# Altium schematic sheet front_ultrasonic_radar.SchDoc
size A3; SheetNumber: 4; SheetTotal: 6
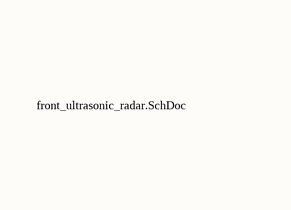
[diagram p0: front_ultrasonic_radar.SchDoc, left]
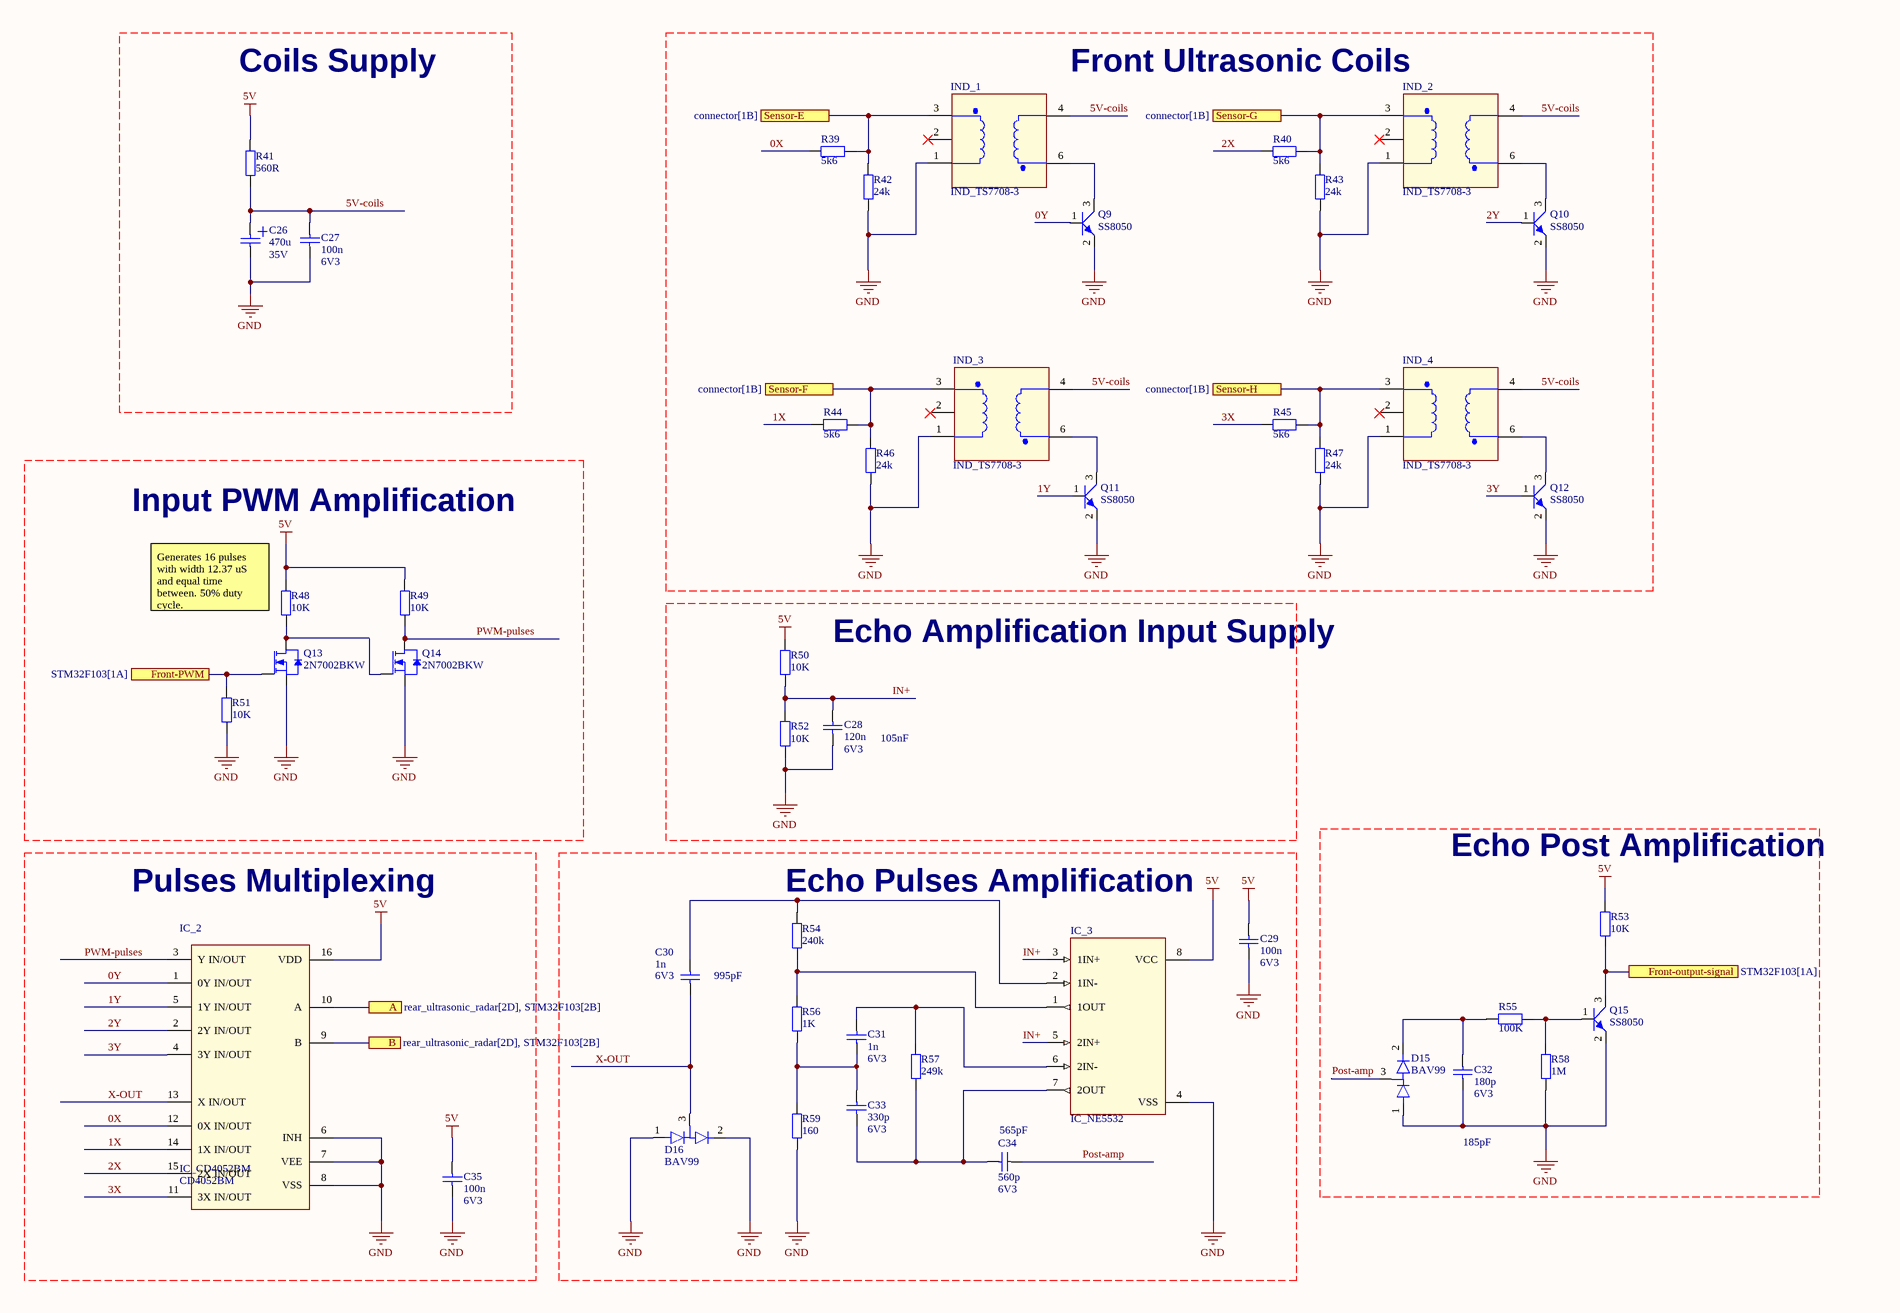
[diagram p1: front_ultrasonic_radar.SchDoc, right]

## Parts
C26  Value1: 470u  Value2: 35V  [CAP_Panasonic_EEE-FK1V471SP]  (hidden comment: CAP_POL)
C27  Value1: 100n  Value2: 6V3  [CAPC2012X88N]  (hidden comment: CAP)
C28  Value1: 120n  Value2: 6V3  [CAPC2012X88N]  (hidden comment: CAP)
C29  Value1: 100n  Value2: 6V3  [CAPC2012X88N]  (hidden comment: CAP)
C30  Value1: 1n  Value2: 6V3  [CAPC2012X88N]  (hidden comment: CAP)
C31  Value1: 1n  Value2: 6V3  [CAPC2012X88N]  (hidden comment: CAP)
C32  Value1: 180p  Value2: 6V3  [CAPC2012X88N]  (hidden comment: CAP)
C33  Value1: 330p  Value2: 6V3  [CAPC2012X88N]  (hidden comment: CAP)
C34  Value1: 560p  Value2: 6V3  [CAPC2012X88N]  (hidden comment: CAP)
C35  Value1: 100n  Value2: 6V3  [CAPC2012X88N]  (hidden comment: CAP)
D15  Value1: BAV99  [DIO_BAV99-SOT23]  (hidden comment: High-speed double diode)
D16  Value1: BAV99  [DIO_BAV99-SOT23]  (hidden comment: High-speed double diode)
IC_2  IC_CD4052BM  Value1: CD4052BM  [SOP-16]
IC_3  IC_NE5532
IND_1  IND_TS7708-3
IND_2  IND_TS7708-3
IND_3  IND_TS7708-3
IND_4  IND_TS7708-3
Q9  Value1: SS8050  [SOT23]  (hidden comment: TRS_NPN_123)
Q10  Value1: SS8050  [SOT23]  (hidden comment: TRS_NPN_123)
Q11  Value1: SS8050  [SOT23]  (hidden comment: TRS_NPN_123)
Q12  Value1: SS8050  [SOT23]  (hidden comment: TRS_NPN_123)
Q13  Value1: 2N7002BKW  [SOT65P210X110-3N]  (hidden comment: TRS_FETN_123)
Q14  Value1: 2N7002BKW  [SOT65P210X110-3N]  (hidden comment: TRS_FETN_123)
Q15  Value1: SS8050  [SOT23]  (hidden comment: TRS_NPN_123)
R39  Value1: 5k6  [RESC2012X60N]  (hidden comment: RES)
R40  Value1: 5k6  [RESC2012X60N]  (hidden comment: RES)
R41  Value1: 560R  [RESC2012X60N]  (hidden comment: RES)
R42  Value1: 24k  [RESC2012X60N]  (hidden comment: RES)
R43  Value1: 24k  [RESC2012X60N]  (hidden comment: RES)
R44  Value1: 5k6  [RESC2012X60N]  (hidden comment: RES)
R45  Value1: 5k6  [RESC2012X60N]  (hidden comment: RES)
R46  Value1: 24k  [RESC2012X60N]  (hidden comment: RES)
R47  Value1: 24k  [RESC2012X60N]  (hidden comment: RES)
R48  Value1: 10K  [RESC2012X60N]  (hidden comment: RES)
R49  Value1: 10K  [RESC2012X60N]  (hidden comment: RES)
R50  Value1: 10K  [RESC2012X60N]  (hidden comment: RES)
R51  Value1: 10K  [RESC2012X60N]  (hidden comment: RES)
R52  Value1: 10K  [RESC2012X60N]  (hidden comment: RES)
R53  Value1: 10K  [RESC2012X60N]  (hidden comment: RES)
R54  Value1: 240k  [RESC2012X60N]  (hidden comment: RES)
R55  Value1: 100K  [RESC2012X60N]  (hidden comment: RES)
R56  Value1: 1K  [RESC2012X60N]  (hidden comment: RES)
R57  Value1: 249k  [RESC2012X60N]  (hidden comment: RES)
R58  Value1: 1M  [RESC2012X60N]  (hidden comment: RES)
R59  Value1: 160  [RESC2012X60N]  (hidden comment: RES)

## Ports
A (see rear_ultrasonic_radar[2D], STM32F103[2B]), B (see rear_ultrasonic_radar[2D], STM32F103[2B]), Front-output-signal (see STM32F103[1A]), Front-PWM (see STM32F103[1A]), Sensor-E (see connector[1B]), Sensor-F (see connector[1B]), Sensor-G (see connector[1B]), Sensor-H (see connector[1B])

## Nets
5V: C29.2 C35.2 IC_2.16(VDD) IC_3.8(VCC) R41.2 R48.2 R49.2 R50.1 R53.2
GND: C26.2 C27.1 C28.1 C29.1 C32.1 C35.1 D15.1(A1) D16.1(A1) D16.2(A2) IC_2.6(INH) IC_2.7(VEE) IC_2.8(VSS) IC_3.4(VSS) IND_1.1 IND_2.1 IND_3.1 IND_4.1 Q9.2(E) Q10.2(E) Q11.2(E) Q12.2(E) Q13.2(S) Q14.2(S) Q15.2(E) R42.1 R43.1 R46.1 R47.1 R51.1 R52.1 R58.1 R59.1
0X: IC_2.12(0X_IN/OUT) R39.2
0Y: IC_2.1(0Y_IN/OUT) Q9.1(B)
1X: IC_2.14(1X_IN/OUT) R44.2
1Y: IC_2.5(1Y_IN/OUT) Q11.1(B)
2X: IC_2.15(2X_IN/OUT) R40.2
2Y: IC_2.2(2Y_IN/OUT) Q10.1(B)
3X: IC_2.11(3X_IN/OUT) R45.2
3Y: IC_2.4(3Y_IN/OUT) Q12.1(B)
5V-coils: C26.1 C27.2 IND_1.4 IND_2.4 IND_3.4 IND_4.4 R41.1
A: IC_2.10(A) ; port A
B: IC_2.9(B) ; port B
Front-output-signal: Q15.3(C) R53.1 ; port Front-output-signal
Front-PWM: Q13.1(G) R51.2 ; port Front-PWM
IN+: C28.2 IC_3.3(1IN+) IC_3.5(2IN+) R50.2 R52.2
Post-amp: C34.1 D15.3(K)
PWM-pulses: IC_2.3(Y_IN/OUT) Q14.3(D) R49.1
Sensor-E: IND_1.3(S2) R39.1 R42.2 ; port Sensor-E
Sensor-F: IND_3.3(S2) R44.1 R46.2 ; port Sensor-F
Sensor-G: IND_2.3(S2) R40.1 R43.2 ; port Sensor-G
Sensor-H: IND_4.3(S2) R45.1 R47.2 ; port Sensor-H
X-OUT: C30.1 D16.3(K) IC_2.13(X_IN/OUT)
NetC30_2: C30.2 IC_3.2(1IN-) R54.1
NetC31_1: C31.1 IC_3.6(2IN-) R57.1
NetC31_2: C31.2 C33.2 R56.1 R59.2
NetC32_2: C32.2 D15.2(A2) R55.1
NetC33_1: C33.1 C34.2 IC_3.7(2OUT) R57.2
NetIC_3_1: IC_3.1(1OUT) R54.2 R56.2
NetIND_1_6: IND_1.6(S1) Q9.3(C)
NetIND_2_6: IND_2.6(S1) Q10.3(C)
NetIND_3_6: IND_3.6(S1) Q11.3(C)
NetIND_4_6: IND_4.6(S1) Q12.3(C)
NetQ13_3: Q13.3(D) Q14.1(G) R48.1
NetQ15_1: Q15.1(B) R55.2 R58.2

Not connected (* = marked no-connect by the designer): IND_1 2*; IND_2 2*; IND_3 2*; IND_4 2*

## Notes on the sheet
- Coils Supply
- Front Ultrasonic Coils
- Input PWM Amplification
- (near R48) Generates 16 pulses with width 12.37 uS and equal time between. 50% duty cycle.
- front_ultrasonic_radar.SchDoc
- Echo Amplification Input Supply
- (near C28) 105nF
- (near R53) Echo Post Amplification
- Pulses Multiplexing
- (near R54) Echo Pulses Amplification
- (near C30) 995pF
- (near C34) 565pF
- 185pF

## Library data of the parts
C26 = 01_01555: Aluminium Electrolytic Capacitors - SMD 35volts 470uF SMD AEC-Q200 Reflow Only; Manufacturer: Panasonic; Manufacturer PN: EEE-FK1V471SP; AutoId: 1556; SubType: Electrolyte; Id: 01_01555; DeviceType: capacitor; Status: 0 - Unchecked; MountType: SMT; ComponentLink1URL: X:\01_Datasheets\CAP_Panasonic_FKS.pdf; Supplier 1: Mouser; Supplier Part Number 1: 667-EEE-FK1V471SP; ComponentLink1Description: Datasheet
C27 C29 C35 = 01_00637: X7R 10% 0805; Manufacturer: KEMET; Manufacturer PN: C0805C104K9RACTU; AutoId: 637; DeviceType: capacitor; SubType: Ceramic; Id: 01_00637; Status: 2 - Checked and Approved; MountType: SMT; ComponentLink1URL: X:\01_Datasheets\CAP_KEMET_CxxxxCxxxXxRAC.pdf; Supplier 1: Farnell; Supplier Part Number 1: 80-C0805C104K9R; ComponentLink1Description: Datasheet
C28 = 01_00638: X7R 10% 0805; Manufacturer: KEMET; Manufacturer PN: C0805C124K9RACTU; AutoId: 638; DeviceType: capacitor; SubType: Ceramic; Id: 01_00638; Status: 2 - Checked and Approved; MountType: SMT; ComponentLink1URL: X:\01_Datasheets\CAP_KEMET_CxxxxCxxxXxRAC.pdf; Supplier 1: Farnell; ComponentLink1Description: Datasheet
C30 C31 = 01_00613: X7R 10% 0805; Manufacturer: KEMET; Manufacturer PN: C0805C102K9RACTU; AutoId: 613; DeviceType: capacitor; SubType: Ceramic; Id: 01_00613; Status: 2 - Checked and Approved; MountType: SMT; ComponentLink1URL: X:\01_Datasheets\CAP_KEMET_CxxxxCxxxXxRAC.pdf; Supplier 1: Farnell; ComponentLink1Description: Datasheet
C32 = 01_00604: X7R 10% 0805; Manufacturer: KEMET; Manufacturer PN: C0805C181K9RACTU; AutoId: 604; DeviceType: capacitor; SubType: Ceramic; Id: 01_00604; Status: 2 - Checked and Approved; MountType: SMT; ComponentLink1URL: X:\01_Datasheets\CAP_KEMET_CxxxxCxxxXxRAC.pdf; Supplier 1: Farnell; ComponentLink1Description: Datasheet
C33 = 01_00607: X7R 10% 0805; Manufacturer: KEMET; Manufacturer PN: C0805C331K9RACTU; AutoId: 607; DeviceType: capacitor; SubType: Ceramic; Id: 01_00607; Status: 2 - Checked and Approved; MountType: SMT; ComponentLink1URL: X:\01_Datasheets\CAP_KEMET_CxxxxCxxxXxRAC.pdf; Supplier 1: Farnell; ComponentLink1Description: Datasheet
C34 = 01_00610: X7R 10% 0805; Manufacturer: KEMET; Manufacturer PN: C0805C561K9RACTU; AutoId: 610; DeviceType: capacitor; SubType: Ceramic; Id: 01_00610; Status: 2 - Checked and Approved; MountType: SMT; ComponentLink1URL: X:\01_Datasheets\CAP_KEMET_CxxxxCxxxXxRAC.pdf; Supplier 1: Farnell; ComponentLink1Description: Datasheet
D15 D16 = 03_00102: Manufacturer: Philips; AutoId: 120; Value2: 75В 215mА; Value3: Ultra fast; Id: 03_00102; Manufacturer PN: BAV99; DeviceType: diode; Status: 0 - Unchecked; MountType: SMD; ComponentLink1Description: Datasheet; ComponentLink1URL: X:\01_Datasheets\BAV99.pdf; ComponentLink2Description: ComponentVerificationSheet; ComponentLink2URL: X:\02_ComponentVerificationSheets\
IC_2 = 07_00294: Dual 4-Channel Analog Multiplexer/Demultiplexer; Manufacturer: Texas Instruments; AutoId: 301; Value2: 16 pin  Multiplexer/Demultiplexer; DeviceType: IC; Id: 07_00294; Manufacturer PN: CD4052BM; Status: 0 - Unchecked; MountType: SMT; ComponentLink1Description: Datasheet; ComponentLink1URL: X:\01_Datasheets\IC_CD4052BM.pdf; ComponentLink2Description: ComponentVerificationSheet; ComponentLink2URL: X:\02_ComponentVerificationSheets\
IC_3 = IC_NE5532: Dual low-noise operational amplifier 
IND_1-IND_4 = IND_TS7708-3: 12times Amplifying Transformer,IFT Inductors for Ultrasonic Sensors
Q9-Q12 Q15 = 19_00050: Bipolar Transistors - BJT NPN TRANSISTOR 1.5A 40V; Manufacturer: KooChin; AutoId: 57; Value2: 40V 1,5A; Id: 19_00050; Manufacturer PN: SS8050; DeviceType: transistor; SubType: NPN; Status: 0 - Unchecked; MountType: SMT; ComponentLink1Description: Datasheet; ComponentLink1URL: X:\01_Datasheets\SS8050.pdf; ComponentLink2Description: ComponentVerificationSheet; ComponentLink2URL: X:\02_ComponentVerificationSheets\
Q13 Q14 = 19_00024: NXP - 2N7002BKW - MOSFET, N CH, 60V, 0.31A, SOT323; AutoId: 24; DeviceType: transistor; Id: 19_00024; Value2: n/a; Manufacturer: NXP; Manufacturer PN: 2N7002BKW; SubType: MOSFET; Status: 2 - Checked and Approved; MountType: SMD; ComponentLink1Description: Datasheet; ComponentLink1URL: X:\01_dataSheets\TRS_NXP_2N7002BKW.pdf; ComponentLink2Description: ComponentVerificationSheet; ComponentLink2URL: X:\02_ComponentVerificationSheets\; Supplier 1: Farnell; Supplier Part Number 1: 1894713RL
R39 R40 R44 R45 = 15_10611: RESISTOR, 0805, 5k6, 1%, SMD; Manufacturer: Yageo; AutoId: 674; Value2: 0W125; SubType: Metal film; Id: 15_10611; DeviceType: resistor; Status: 0 - Unchecked; MountType: SMT; ComponentLink1Description: Datasheet; ComponentLink1URL: X:\01_Datasheets\
R41 = 15_00326: RESISTOR, 0805, 560R, 1%, SMD; Manufacturer: Yageo; Manufacturer PN: RC0805FR-07560R; AutoId: 326; Value2: 0W125; SubType: Metal film; Id: 15_00326; DeviceType: resistor; Status: 2 - Checked and Approved; MountType: SMT; ComponentLink1Description: Datasheet; ComponentLink1URL: X:\01_Datasheets\RES_YAGEO_RC0805FR.pdf; Supplier 1: Farnell; Supplier Part Number 1: 9237461
R42 R43 R46 R47 = 15_10610: RESISTOR, 0805, 24k, 1%, SMD; Manufacturer: Yageo; AutoId: 673; Value2: 0W125; SubType: Metal film; Id: 15_10610; DeviceType: resistor; Status: 0 - Unchecked; MountType: SMT; ComponentLink1Description: Datasheet; ComponentLink1URL: X:\01_Datasheets\
R48-R53 = 15_00341: RESISTOR, 0805, 10K, 1%, SMD; Manufacturer: Yageo; Manufacturer PN: RC0805FR-0710K; AutoId: 341; Value2: 0W125; SubType: Metal film; Id: 15_00341; DeviceType: resistor; Status: 0 - Unchecked; MountType: SMT; ComponentLink1Description: Datasheet; ComponentLink1URL: X:\01_Datasheets\RES_YAGEO_RC0805FR.pdf; Supplier 1: Farnell
R54 = 15_10613: RESISTOR, 0805, 240k, 1%, SMD; Manufacturer: Yageo; AutoId: 676; Value2: 0W125; SubType: Metal film; Id: 15_10613; DeviceType: resistor; Status: 0 - Unchecked; MountType: SMT; ComponentLink1Description: Datasheet; ComponentLink1URL: X:\01_Datasheets\
R55 = 15_00353: RESISTOR, 0805, 100K, 1%, SMD; Manufacturer: Yageo; Manufacturer PN: RC0805FR-07100K; AutoId: 353; Value2: 0W125; SubType: Metal film; Id: 15_00353; DeviceType: resistor; Status: 0 - Unchecked; MountType: SMT; ComponentLink1Description: Datasheet; ComponentLink1URL: X:\01_Datasheets\RES_YAGEO_RC0805FR.pdf; Supplier 1: Farnell
R56 = 15_00329: RESISTOR, 0805, 1K, 1%, SMD; Manufacturer: Yageo; Manufacturer PN: RC0805FR-071K; AutoId: 329; Value2: 0W125; SubType: Metal film; Id: 15_00329; DeviceType: resistor; Status: 2 - Checked and Approved; MountType: SMT; ComponentLink1Description: Datasheet; ComponentLink1URL: X:\01_Datasheets\RES_YAGEO_RC0805FR.pdf; Supplier 1: Farnell; Supplier Part Number 1: 9237496
R57 = 15_10614: RESISTOR, 0805, 249k, 1%, SMD; Manufacturer: Yageo; AutoId: 677; Value2: 0W125; SubType: Metal film; Id: 15_10614; DeviceType: resistor; Status: 0 - Unchecked; MountType: SMT; ComponentLink1Description: Datasheet; ComponentLink1URL: X:\01_Datasheets\
R58 = 15_00365: RESISTOR, 0805, 1M, 1%, SMD; Manufacturer: Yageo; Manufacturer PN: RC0805FR-071M; AutoId: 365; Value2: 0W125; SubType: Metal film; Id: 15_00365; DeviceType: resistor; Status: 0 - Unchecked; MountType: SMT; ComponentLink1Description: Datasheet; ComponentLink1URL: X:\01_Datasheets\RES_YAGEO_RC0805FR.pdf; Supplier 1: Farnell
R59 = 15_10612: RESISTOR, 0805, 160, 1%, SMD; Manufacturer: Yageo; AutoId: 675; Value2: 0W125; SubType: Metal film; Id: 15_10612; DeviceType: resistor; Status: 0 - Unchecked; MountType: SMT; ComponentLink1Description: Datasheet; ComponentLink1URL: X:\01_Datasheets\